# Altium schematic sheet POS5V.SchDoc
size B
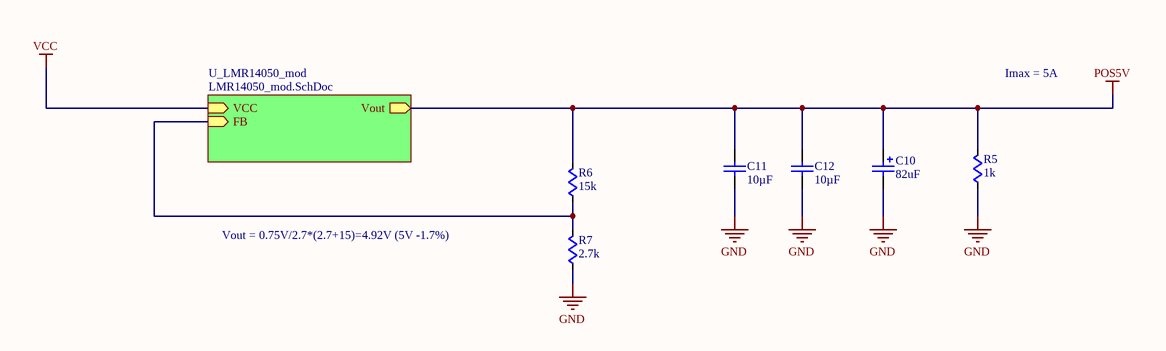
[diagram p0: POS5V.SchDoc]

## Parts
C10  value 82uF  [CAP_EEFK_D8]  (hidden comment: EEEFK1V680XP)
C11  value 10µF  [C0805]  (hidden comment: Cap)
C12  value 10µF  [C0805]  (hidden comment: Cap)
R5  value 1k  [R0805]  (hidden comment: Res)
R6  value 15k  [R0805]  (hidden comment: Res)
R7  value 2.7k  [R0805]  (hidden comment: Res)

## Sub-sheets
U_LMR14050_mod = LMR14050_mod.SchDoc: VCC (in), FB (in), Vout (out)

## Nets
GND: C10.2 C11.1 C12.1 R5.1 R7.1
POS5V: C10.1 C11.2 C12.2 R5.2 R6.2 ; sheet U_LMR14050_mod/Vout
VCC: sheet U_LMR14050_mod/VCC
NetR6_1: R6.1 R7.2 ; sheet U_LMR14050_mod/FB

## Notes on the sheet
- Imax = 5A
- Vout = 0.75V/2.7*(2.7+15)=4.92V (5V -1.7%)

## Library data of the parts
C10 = EEEFK1V680XP: Polarized Capacitor (Surface Mount); Vendor: Panasonic; Built_By: EMA_UL_Team; C: Copyright (C) 2015 Accelerated Designs. All rights reserved; Manufacturer_Part_Number: EEEFK1V680XP; Supplier 1: Digi-Key; Supplier Part Number 1: P18960DKR-ND
C11 C12 = Cap: capacitor
R5-R7 = Res: resistor